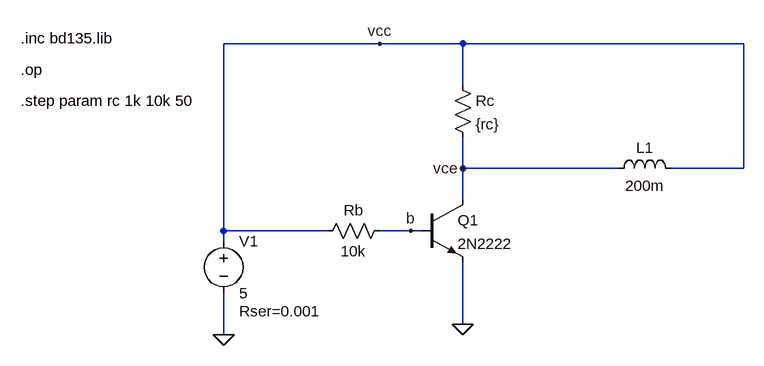
[diagram p0: schematic R_sweep.asc]
R_sweep.asc, the LTspice schematic file:
Version 4
SHEET 1 880 680
WIRE 80 -128 -160 -128
WIRE 208 -128 80 -128
WIRE 640 -128 208 -128
WIRE 208 -64 208 -128
WIRE 208 64 208 16
WIRE 448 64 208 64
WIRE 640 64 640 -128
WIRE 640 64 528 64
WIRE 208 112 208 64
WIRE -160 160 -160 -128
WIRE 0 160 -160 160
WIRE 128 160 80 160
WIRE 144 160 128 160
WIRE -160 176 -160 160
WIRE 208 304 208 208
WIRE -160 320 -160 256
FLAG 208 304 0
FLAG -160 320 0
FLAG 208 64 vce
FLAG 128 160 b
FLAG 80 -128 vcc
SYMBOL npn 144 112 R0
SYMATTR InstName Q1
SYMATTR Value 2N2222
SYMBOL res 96 144 R90
WINDOW 0 0 56 VBottom 2
WINDOW 3 32 56 VTop 2
SYMATTR InstName Rb
SYMATTR Value 10k
SYMBOL res 192 -80 R0
SYMATTR InstName Rc
SYMATTR Value {rc}
SYMBOL voltage -160 160 R0
WINDOW 123 0 0 Left 0
WINDOW 39 24 124 Left 2
SYMATTR InstName V1
SYMATTR Value 5
SYMATTR SpiceLine Rser=0.001
SYMBOL ind 432 80 R270
WINDOW 0 32 56 VTop 2
WINDOW 3 5 56 VBottom 2
SYMATTR InstName L1
SYMATTR Value 200m
SYMATTR SpiceLine Rser=165
TEXT -472 -136 Left 2 !.inc bd135.lib
TEXT -472 -88 Left 2 !.op
TEXT -472 -40 Left 2 !.step param rc 1k 10k 50

The netlist it stands for:
* R_sweep.asc
Q1 vce b 0 0 2N2222
Rb b vcc 10k
Rc vcc vce {rc}
V1 vcc 0 5 Rser=0.001
L1 vce vcc 200m Rser=165
.model NPN NPN
.model PNP PNP
.lib standard.bjt
.inc bd135.lib
.op
.step param rc 1k 10k 50
.backanno
.end

* Results of the author's LTspice run, read from the files saved beside the schematic
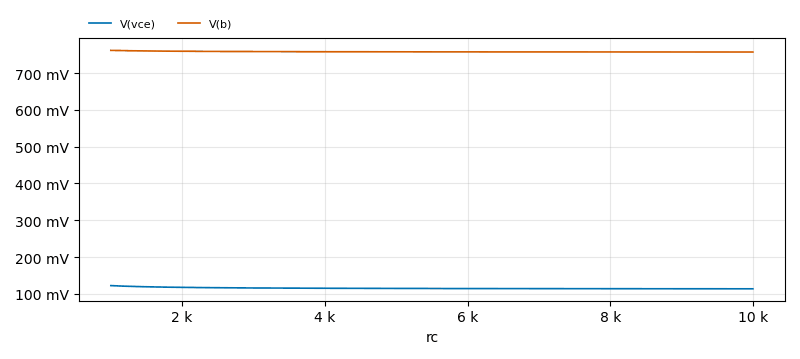
[diagram p1: Operating Point of R_sweep.asc, plotted from the saved traces]
* Operating Point, 1 run:
*   V(vce): 122.6 mV at rc=1 k, 114 mV at rc=10 k, min 114 mV, max 122.6 mV
*   V(b): 761.5 mV at rc=1 k, 757 mV at rc=10 k, min 757 mV, max 761.5 mV
* From the log:
*   Semiconductor Device Operating Points:
*                           --- Bipolar Transistors ---
*   Name:       q1
*   Model:    2n2222
*   Ib:       4.24e-04
*   Ic:       3.44e-02
*   Vbe:      7.62e-01
*   Vbc:      6.39e-01
*   Vce:      1.23e-01
*   BetaDC:   8.12e+01
*   Gm:       1.21e+00
*   Rpi:      1.30e+02
*   Rx:       1.00e+01
*   Ro:       4.24e+01
*   Cbe:      5.43e-10
*   Cbc:      2.63e-09
*   Cjs:      0.00e+00
*   BetaAC:   1.58e+02
*   Cbx:      0.00e+00
*   Ft:       6.08e+07